# Altium schematic sheet master.SchDoc
size B
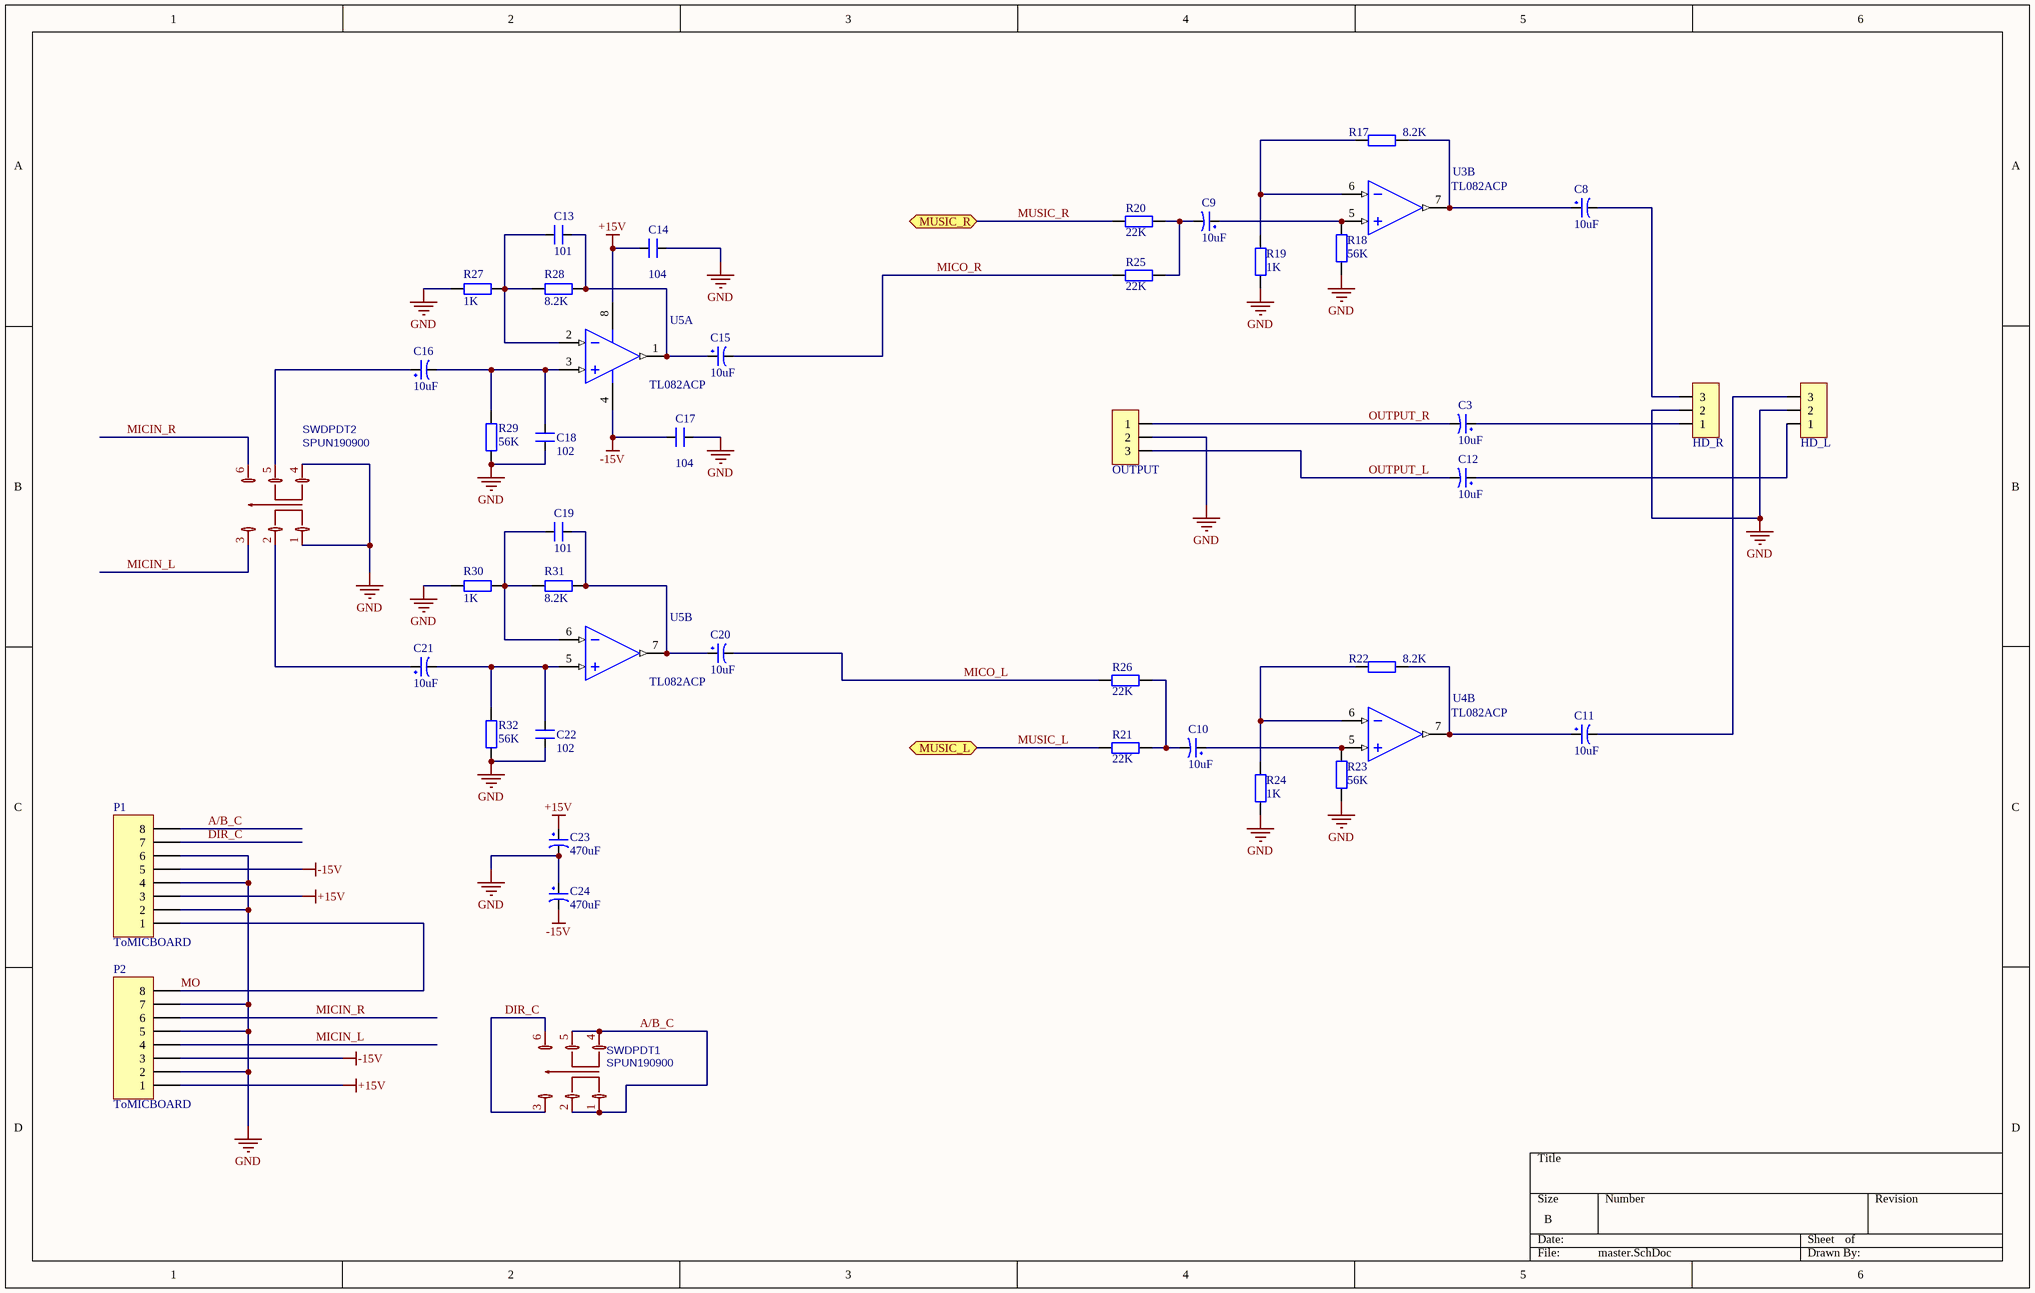
[diagram p0: master.SchDoc]

## Parts
C3  10uF  [CAP5x12]
C8  10uF  [CAP5x12]
C9  10uF  [CAP5x12]
C10  10uF  [CAP5x12]
C11  10uF  [CAP5x12]
C12  10uF  [CAP5x12]
C13  101  [TU_GOM(104-->105pF)]
C14  104  [TU_GOM(104-->105pF)]
C15  10uF  [CAP5x12]
C16  10uF  [CAP5x12]
C17  104  [TU_GOM(104-->105pF)]
C18  102  [TU_GOM(104-->105pF)]
C19  101  [TU_GOM(104-->105pF)]
C20  10uF  [CAP5x12]
C21  10uF  [CAP5x12]
C22  102  [TU_GOM(104-->105pF)]
C23  470uF  [TU_HOA(100uF/35V - 470uF/16V)]
C24  470uF  [TU_HOA(100uF/35V - 470uF/16V)]
HD_L  Header 3_MH  [HEADER 3]  (value not drawn)
HD_R  Header 3_MH  [HEADER 3]  (value not drawn)
OUTPUT  Header 3_MH  [HEADER 3]  (value not drawn)
P1  ToMICBOARD  [HEADER2M_8P]
P2  ToMICBOARD  [HEADER 8]
R17  8.2K  [TRO_VACH_ 1/4W]
R18  56K  [TRO_VACH_ 1/4W]
R19  1K  [TRO_VACH_ 1/4W]
R20  22K  [TRO_VACH_ 1/4W]
R21  22K  [TRO_VACH_ 1/4W]
R22  8.2K  [TRO_VACH_ 1/4W]
R23  56K  [TRO_VACH_ 1/4W]
R24  1K  [TRO_VACH_ 1/4W]
R25  22K  [TRO_VACH_ 1/4W]
R26  22K  [TRO_VACH_ 1/4W]
R27  1K  [TRO_VACH_ 1/4W]
R28  8.2K  [TRO_VACH_ 1/4W]
R29  56K  [TRO_VACH_ 1/4W]
R30  1K  [TRO_VACH_ 1/4W]
R31  8.2K  [TRO_VACH_ 1/4W]
R32  56K  [TRO_VACH_ 1/4W]
SWDPDT1  SPUN190900  [SW-DIP-P42X10]
SWDPDT2  SPUN190900  [SW-DIP-P42X10]
U3  TL082ACP  [DIP8]  (part B of 2)
U4  TL082ACP  [DIP8]  (part B of 2)
U5  TL082ACP  [DIP8]  (parts A,B of 2)

## Ports
MUSIC_L, MUSIC_R

## Nets
+15V: C14.1 C23.1 P1.3 P2.1 U5.8(V+)
-15V: C17.1 C24.2 P1.5 P2.3 U5.4(V-)
GND: C14.2 C17.2 C18.1 C22.1 C23.2 C24.1 HD_L.2 HD_R.2 OUTPUT.2 P1.2 P1.4 P1.6 P2.2 P2.5 P2.7 R18.2 R19.2 R23.2 R24.2 R27.1 R29.1 R30.1 R32.1 SWDPDT2.1 SWDPDT2.4
A/B_C: P1.8 SWDPDT1.1 SWDPDT1.2 SWDPDT1.4 SWDPDT1.5
DIR_C: P1.7 SWDPDT1.3 SWDPDT1.6
MICIN_L: P2.4 SWDPDT2.3
MICIN_R: P2.6 SWDPDT2.6
MICO_L: C20.2 R26.1
MICO_R: C15.2 R25.1
MO: P1.1 P2.8
MUSIC_L: R21.1 ; port MUSIC_L
MUSIC_R: R20.1 ; port MUSIC_R
OUTPUT_L: C12.2 OUTPUT.3
OUTPUT_R: C3.2 OUTPUT.1
NetC3_1: C3.1 HD_R.1
NetC8_1: C8.1 R17.1 U3.7(OUT)
NetC8_2: C8.2 HD_R.3
NetC9_1: C9.1 R18.1 U3.5(IN+)
NetC9_2: C9.2 R20.2 R25.2
NetC10_1: C10.1 R23.1 U4.5(IN+)
NetC10_2: C10.2 R21.2 R26.2
NetC11_1: C11.1 R22.1 U4.7(OUT)
NetC11_2: C11.2 HD_L.3
NetC12_1: C12.1 HD_L.1
NetC13_1: C13.1 C15.1 R28.1 U5.1(OUT)
NetC13_2: C13.2 R27.2 R28.2 U5.2(IN-)
NetC16_1: C16.1 SWDPDT2.5
NetC16_2: C16.2 C18.2 R29.2 U5.3(IN+)
NetC19_1: C19.1 C20.1 R31.1 U5.7(OUT)
NetC19_2: C19.2 R30.2 R31.2 U5.6(IN-)
NetC21_1: C21.1 SWDPDT2.2
NetC21_2: C21.2 C22.2 R32.2 U5.5(IN+)
NetR17_2: R17.2 R19.1 U3.6(IN-)
NetR22_2: R22.2 R24.1 U4.6(IN-)

## Library data of the parts
C3 C8-C12 C15 C20 = TU_HOA_4.7uF_100V_MH: Value: 4700uF/50V
C13 C18 C19 C22 = TU_GOM(104 => 105pF)_MH: Value: 0.1uF
C14 C17 = TU_MICA_ 104 100V(2A104J)_MH: Value: 0.1uF
C16 C21 = TU_HOA_10uF_16V_MH: Value: 10uF/50V; Description 1: 10 => 220uF/6,3V/10V - 10uF => 100uF/16V; Description 2: 0,1uF => 33uF/50V - 10uF => 22uF/63V; Description 3: 0,47uF => 10uF/100V
C23 C24 = TU_HOA_10uF_16V_MH: 10uF; Value: 10uF/50V; Description 1: 10 => 220uF/6,3V/10V - 10uF => 100uF/16V; Description 2: 0,1uF => 33uF/50V - 10uF => 22uF/63V; Description 3: 0,47uF => 10uF/100V
HD_L HD_R OUTPUT = Header 3_MH: Header 3P XH2.54 thẳng
P1 P2 = Header 8: Header, 8-Pin; LatestRevisionDate: 17-Jul-2002; LatestRevisionNote: Re-released for DXP Platform.; Publisher: Altium Limited
R17 R18 R20-R23 R25 R26 = TRO_VACH_1/2W_MH: Resistor; Value: 1K; Published: 8-Jun-2000; LatestRevisionDate: 17-Jul-2002; LatestRevisionNote: Re-released for DXP Platform.; Publisher: Altium Limited
R19 R24 = TRO_VACH_1/2W_MH: Resistor; Published: 8-Jun-2000; LatestRevisionDate: 17-Jul-2002; LatestRevisionNote: Re-released for DXP Platform.; Publisher: Altium Limited; Value: 1K
R27-R32 = TRO_VACH_1/4W_MH
SWDPDT1 SWDPDT2 = SPUN190900: BOM_Manufacturer: ALPS Electric; Contributor: LCSC; BOM_Supplier: LCSC; BOM_Supplier Part: C278339; BOM_Manufacturer Part: SPUN190900; spicePre: S
U3-U5 = TL082ACP: JFET-Input Operational Amplifier; Published: 17-Jul-2002; LatestRevisionDate: 06-Jun-2005; LatestRevisionNote: Stylized 3D Model Added.; DatasheetVersion: 1988; PackageReference: 626-05; Publisher: Altium Limited; PackageDescription: DIP; 8 Leads; Row Spacing 7.62 mm; Pitch 2.54 mm; ComponentLink1Description: Manufacturer Link; ComponentLink1URL: http://www.onsemi.com/site/products/parametrics/0,4446,251,00.html